# EAGLE schematic power_supply (EAGLE 9.1.3)
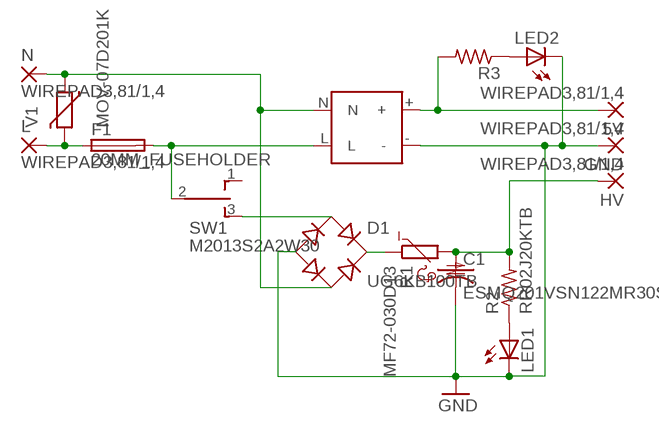
[diagram p0: schematic, sheet 1]

## Parts
5V  WIREPAD3,81/1,4  [3,81/1,4]
C1  ESMQ201VSN122MR30S  [CAPPRD1000W200D3000H3000B]
D1  UG6KB100TB  [UG6KB100TB]
F1  20MM_FUSEHOLDER  [20MM_FUSEHOLDER]
GND  WIREPAD3,81/1,4  [3,81/1,4]
HV  WIREPAD3,81/1,4  [3,81/1,4]
L  WIREPAD3,81/1,4  [3,81/1,4]
LED1  LED5MM  [LED5MM]
LED2  LED5MM  [LED5MM]
M1  IRM-15-5  [IRM-15-5]
N  WIREPAD3,81/1,4  [3,81/1,4]
R1  MF72-030D13  [MF72-030D13]
R2  RR02J20KTB  [RESAD1360W80L900D350B]
R3  R-US_0207/10  [0207/10]
SW1  M2013S2A2W30  [M2013S2A2W30]
V1  MOV-07D201K  [MOV-07D201K]

## Nets
GND: C1.- D1.- GND.1(P) LED1.K(C) LED2.K(C) M1.-
N$1: D1.+ R1.P$1
N$2: C1.+ HV.1(P) R1.P$2 R2.2
N$3: F1.P$2 M1.L SW1.2
N$4: F1.P$1 L.1(P) V1.P$2
N$5: D1.AC1 SW1.3
N$6: 5V.1(P) M1.+ R3.2
N$7: LED1.A R2.1
N$8: D1.AC2 M1.N N.1(P) V1.P$1
N$9: LED2.A R3.1
Unconnected: SW1.1

## Library data of the parts
5V GND HV L N = wirepad:WIREPAD: Wire PAD connect wire on PCB
C1 = tide_clock:ESMQ201VSN122MR30S
D1 = tide_clock:UG6KB100TB
F1 = tide_clock:20MM_FUSEHOLDER
LED1 LED2 = led:LED: LED OSRAM: - CHIPLED LG R971, LG N971, LY N971, LG Q971, LY Q971, LO R971, LY R971 LH N974, LH R974 LS Q976, LO Q976, LY Q976 LO Q996 - Hyper CHIPLED LW Q18S LB Q993, LB Q99A, LB R99A - SideLED LS A670, LO A670, LY A670, LG A670, LP A670 LB A673, LV A673, LT A673, LW A673 LH A674 LY A675 LS A676, LA A676, LO A676, LY A676, LW A676 LS A679, LY A679, LG A679 - Hyper Micro SIDELED® LS Y876, LA Y876, LO Y876, LY Y876 LT Y87S - SmartLED LW L88C, LW L88S LB L89C, LB L89S, LG L890 LS L89K, LO L89K, LY L89K LS L896, LA L896, LO L896, LY L896 - TOPLED LS T670, LO T670, LY T670, LG T670, LP T670 LSG T670, LSP T670, LSY T670, LOP T670, LYG T670 LG T671, LOG T671, LSG T671 LB T673, LV T673, LT T673, LW T673 LH T674 LS T676, LA T676, LO T676, LY T676, LB T676, LH T676, LSB T676, LW T676 LB T67C, LV T67C, LT T67C, LS T67K, LO T67K, LY T67K, LW E67C LS E67B, LA E67B, LO E67B, LY E67B, LB E67C, LV E67C, LT E67C LW T67C LS T679, LY T679, LG T679 LS T770, LO T770, LY T770, LG T770, LP T770 LB T773, LV T773, LT T773, LW T773 LH T774 LS E675, LA E675, LY E675, LS T675 LS T776, LA T776, LO T776, LY T776, LB T776 LHGB T686 LT T68C, LB T68C - Hyper Mini TOPLED® LB M676 - Mini TOPLED Santana® LG M470 LS M47K, LO M47K, LY M47K Source: http://www.osram.convergy.de LUXEON: - LUMILED® LXK2-PW12-R00, LXK2-PW12-S00, LXK2-PW14-U00, LXK2-PW14-V00 LXK2-PM12-R00, LXK2-PM12-S00, LXK2-PM14-U00 LXK2-PE12-Q00, LXK2-PE12-R00, LXK2-PE12-S00, LXK2-PE14-T00, LXK2-PE14-U00 LXK2-PB12-K00, LXK2-PB12-L00, LXK2-PB12-M00, LXK2-PB14-N00, LXK2-PB14-P00, LXK2-PB14-Q00 LXK2-PR12-L00, LXK2-PR12-M00, LXK2-PR14-Q00, LXK2-PR14-R00 LXK2-PD12-Q00, LXK2-PD12-R00, LXK2-PD12-S00 LXK2-PH12-R00, LXK2-PH12-S00 LXK2-PL12-P00, LXK2-PL12-Q00, LXK2-PL12-R00 Source: www.luxeon.com KINGBRIGHT: KA-3528ASYC Source: www.kingbright.com
M1 = tide_clock:IRM-15-5
R1 = tide_clock:MF72-030D13
R2 = tide_clock:RR02J20KTB
R3 = resistor:R-US_: RESISTOR, American symbol
SW1 = tide_clock:M2013S2A2W30
V1 = tide_clock:MOV-07D201K